# Altium project feed.PrjPcb
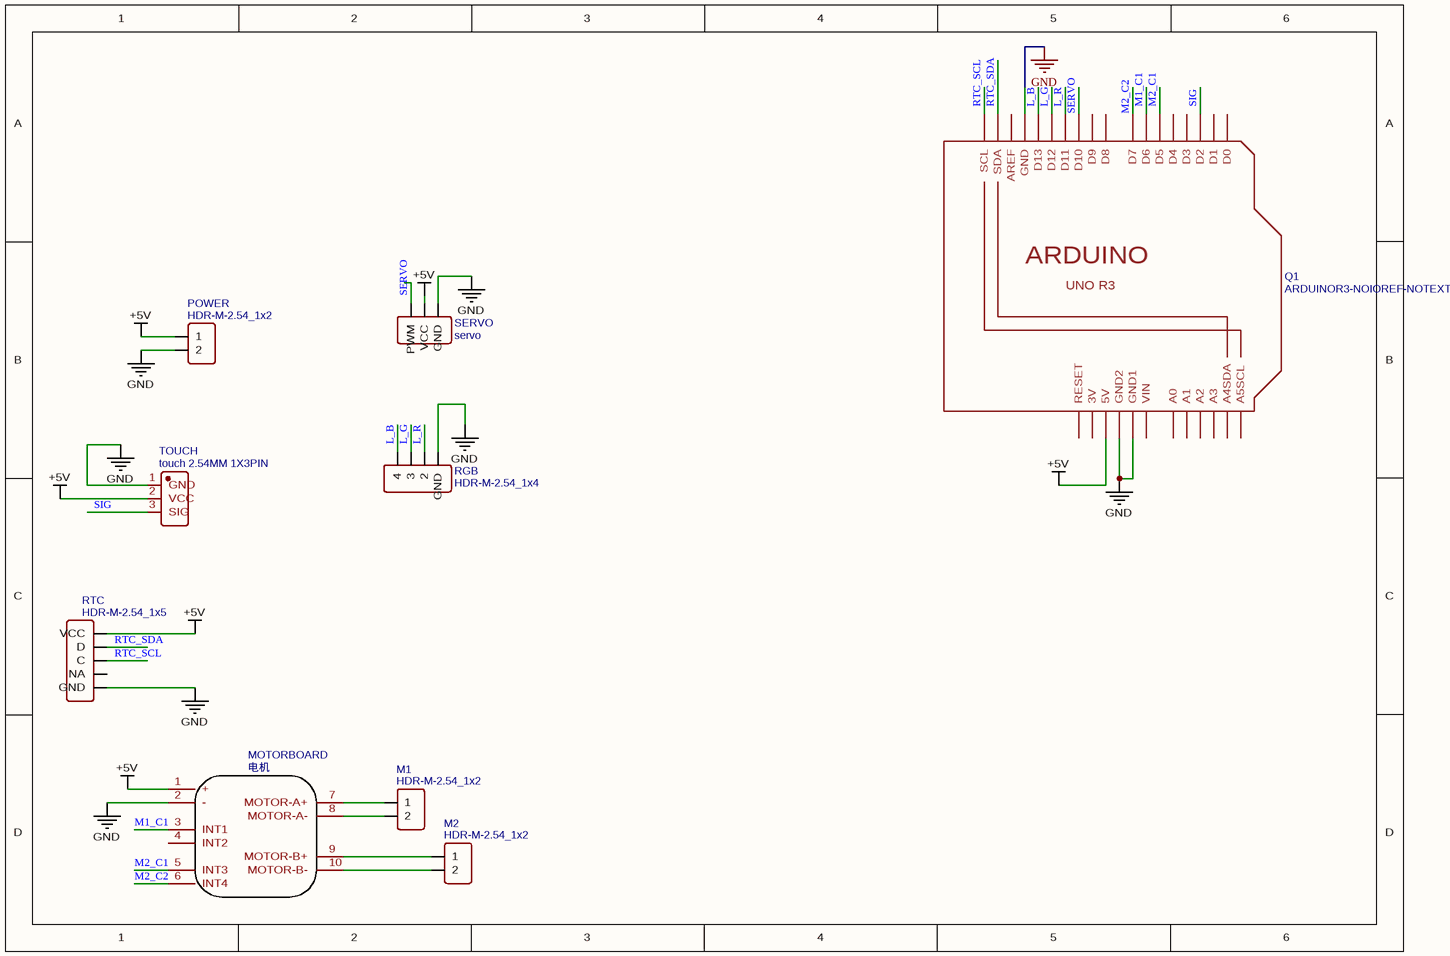
[diagram p0: feed_sch_2024-06-04.schdoc]
1 sheet, 9 parts. Net scope: global (net labels, ports and power ports of the same name join across sheets).
Board file: PCB_feedpcb.pcbdoc

## Sheet feed_sch_2024-06-04.schdoc
size 263 x 177 mm; SheetNumber: 1; SheetTotal: 1

### Parts
M1  HDR-M-2.54_1x2  [HDR-M-2.54_1X2]
M2  HDR-M-2.54_1x2  [HDR-M-2.54_1X2]
MOTORBOARD  电机
POWER  HDR-M-2.54_1x2  [HDR-M-2.54_1X2]
Q1  ARDUINOR3-NOIOREF-NOTEXT  [ARDUINOR3-NOTEXT-NOIOREF]
RGB  HDR-M-2.54_1x4  [HDR-M-2.54_1X4]
RTC  HDR-M-2.54_1x5  [HDR-M-2.54_1X5]
SERVO  servo  [HDR-M-2.54_1X3]
TOUCH  touch 2.54MM 1X3PIN  [HDR-TH_3P-P2.54_CS-1165SDIG]

### Nets
+5V: MOTORBOARD.1(+) POWER.1 Q1.5V RTC.5(VCC) SERVO.2(VCC) TOUCH.2(VCC)
GND: MOTORBOARD.2(-) POWER.2 Q1.GND Q1.GND1 Q1.GND2 RGB.1(GND) RTC.1(GND) SERVO.1(GND) TOUCH.1(GND)
L_B: Q1.D13 RGB.4
L_G: Q1.D12 RGB.3
L_R: Q1.D11 RGB.2
M1_C1: MOTORBOARD.3(INT1) Q1.D6
M2_C1: MOTORBOARD.5(INT3) Q1.D5
M2_C2: MOTORBOARD.6(INT4) Q1.D7
RTC_SCL: Q1.SCL RTC.3(C)
RTC_SDA: Q1.SDA RTC.4(D)
SERVO: Q1.D10 SERVO.3(PWM)
SIG: Q1.D2 TOUCH.3(SIG)
NetM1_1: M1.1 MOTORBOARD.7(MOTOR-A+)
NetM1_2: M1.2 MOTORBOARD.8(MOTOR-A-)
NetM2_1: M2.1 MOTORBOARD.9(MOTOR-B+)
NetM2_2: M2.2 MOTORBOARD.10(MOTOR-B-)

Not connected (* = marked no-connect by the designer): MOTORBOARD 4(INT2); Q1 3V A0 A1 A2 A3 A4(A4SDA) A5(A5SCL) AREF D0 D1 D3 D4 D8 D9 RESET VIN; RTC 2(NA)

### Notes on the sheet
- (in symbol ARDUINOR3-NOIOREF-NOTEXT) ARDUINO; UNO R3

### Library data of the parts
M1 M2 POWER = HDR-M-2.54_1x2: Contributor: LCEDA_Lib; Supplier Part: C124375; Supplier: LCSC; spicePre: J; spiceSymbolName: HDR-M-2.54_1x2
MOTORBOARD = 电机: Contributor: lzy202040923021; spicePre: U; spiceSymbolName: 电机
Q1 = ARDUINOR3-NOIOREF-NOTEXT: Contributor: Adafruit; Package Display: No; spicePre: Q; spiceSymbolName: ARDUINOR3-NOIOREF-NOTEXT
RGB = HDR-M-2.54_1x4: Contributor: aumster; Supplier Part: C124378; Supplier: LCSC; spicePre: J; spiceSymbolName: HDR-M-2.54_1x4
RTC = HDR-M-2.54_1x5: Contributor: wuyan05; Supplier Part: C358687; Supplier: LCSC; spicePre: J; spiceSymbolName: HDR-M-2.54_1x5
SERVO = servo: Contributor: tdddddddd; Supplier Part: C180248; Supplier: LCSC; spicePre: J; spiceSymbolName: HDR-M-2.54_1x3
TOUCH = touch 2.54MM 1X3PIN: Manufacturer: null; Manufacturer Part: 排母2.54mm 1X3pin; Contributor: lcsc; Supplier: LCSC; Supplier Part: C9900016709; JLCPCB Part Class: Extended Part; spicePre: U; spiceSymbolName: 排母2.54MM 1X3PIN